# Altium schematic sheet 4_Connectors.SchDoc
size A4; SheetNumber: 4; SheetTotal: 4
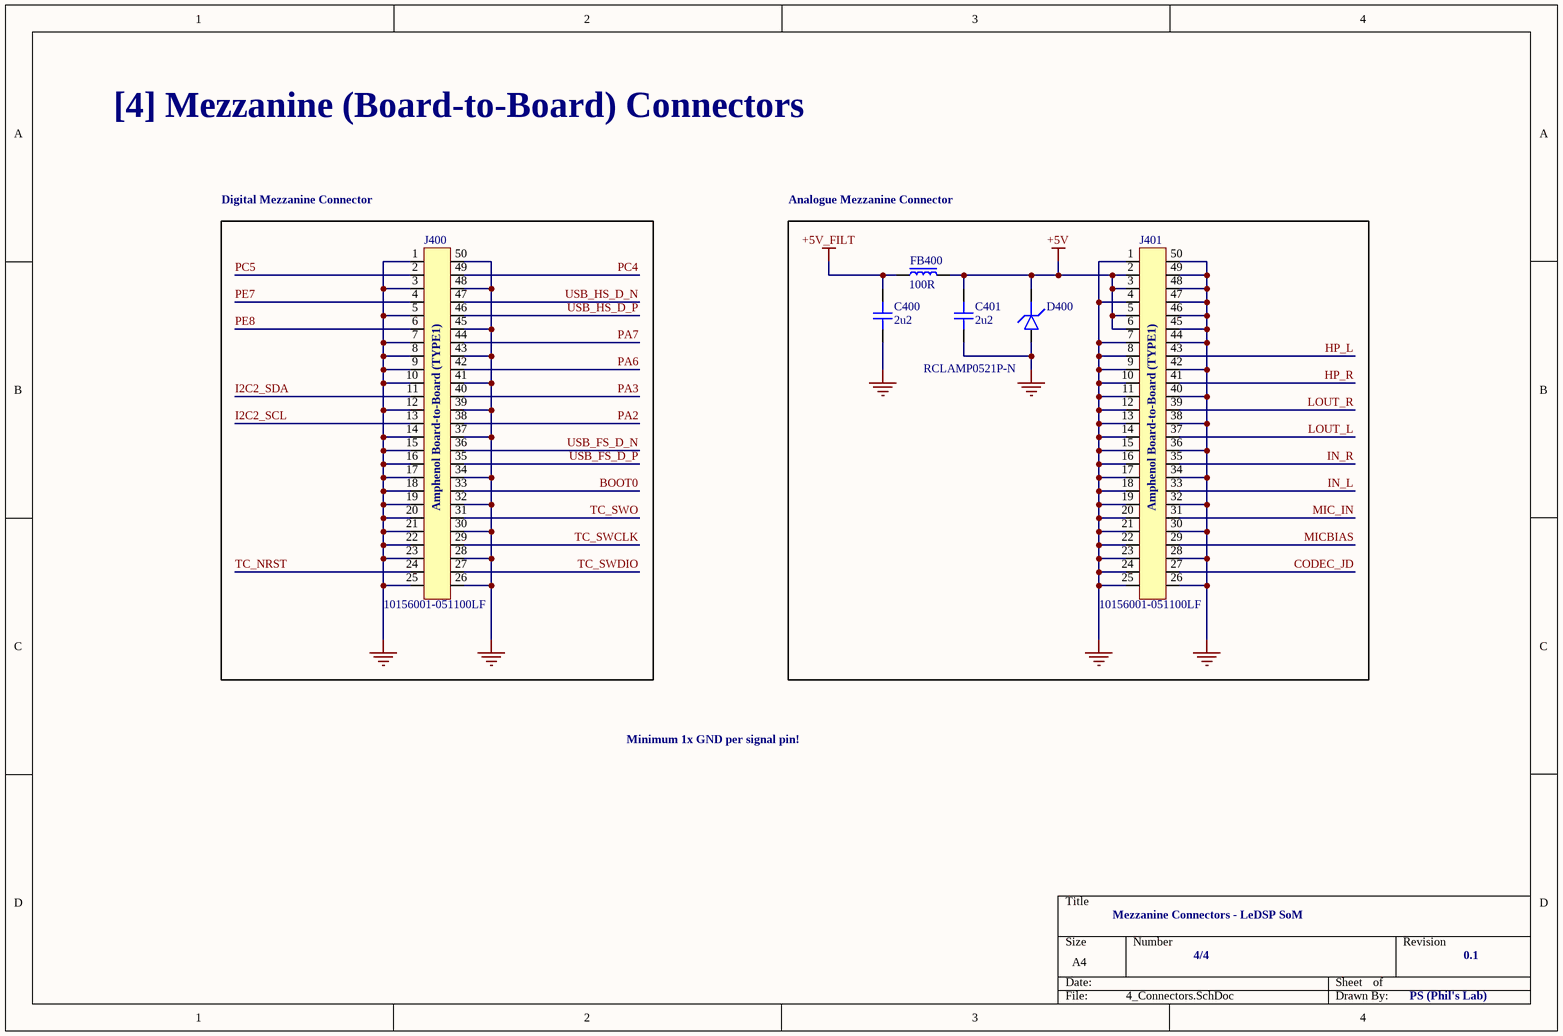
[diagram p0: 4_Connectors.SchDoc]

## Parts
C400  2u2  [CAP_0603]
C401  2u2  [CAP_0603]
D400  RCLAMP0521P-N  [D_0402]
FB400  100R  [FB_0603]
J400  10156001-051100LF  [10156001-051100LF]
J401  10156001-051100LF  [10156001-051100LF]

## Blocks framed on the sheet
Digital Mezzanine Connector: J400
Analogue Mezzanine Connector: C400 C401 D400 FB400 J401

## Nets
+5V: C401.2 D400.K FB400.2 J401.2 J401.3 J401.5 J401.6
+5V_FILT: C400.2 FB400.1
GND: C400.1 C401.1 D400.A J400.1 J400.3 J400.5 J400.7 J400.8 J400.9 J400.10 J400.12 J400.14 J400.15 J400.16 J400.17 J400.18 J400.19 J400.20 J400.21 J400.22 J400.23 J400.25 J400.26 J400.28 J400.30 J400.32 J400.34 J400.37 J400.39 J400.41 J400.43 J400.45 J400.48 J400.50 J401.1 J401.4 J401.7 J401.8 J401.9 J401.10 J401.11 J401.12 J401.13 J401.14 J401.15 J401.16 J401.17 J401.18 J401.19 J401.20 J401.21 J401.22 J401.23 J401.24 J401.25 J401.26 J401.28 J401.30 J401.32 J401.34 J401.36 J401.38 J401.40 J401.42 J401.44 J401.45 J401.46 J401.47 J401.48 J401.49 J401.50
BOOT0: J400.33
CODEC_JD: J401.27
HP_L: J401.43
HP_R: J401.41
I2C2_SCL: J400.13
I2C2_SDA: J400.11
IN_L: J401.33
IN_R: J401.35
LOUT_L: J401.37
LOUT_R: J401.39
MIC_IN: J401.31
MICBIAS: J401.29
PA2: J400.38
PA3: J400.40
PA6: J400.42
PA7: J400.44
PC4: J400.49
PC5: J400.2
PE7: J400.4
PE8: J400.6
TC_NRST: J400.24
TC_SWCLK: J400.29
TC_SWDIO: J400.27
TC_SWO: J400.31
USB_FS_D_N: J400.36
USB_FS_D_P: J400.35
USB_HS_D_N: J400.47
USB_HS_D_P: J400.46

## Notes on the sheet
- [4] Mezzanine (Board-to-Board) Connectors
- Minimum 1x GND per signal pin!
- Mezzanine Connectors - LeDSP SoM
- 4/4
- 0.1
- PS (Phil's Lab)
- (in symbol 10156001-051100LF) Amphenol Board-to-Board (TYPE1)

## Library data of the parts
C400 C401 = CAP_0603_16V: Capacitor SMD 0603 16V
D400 = D_TVS_0402: Diode TVS / ESD 0402
FB400 = FB_0603: Ferrite Bead SMD 0603
J400 J401 = 10156001-051100LF: Board-to-Board Connector 0.5mm Pitch 50 Position 2 Row; Manufacturer: Amphenol FCI; Manufacturer Part Number: 10156001-051100LF